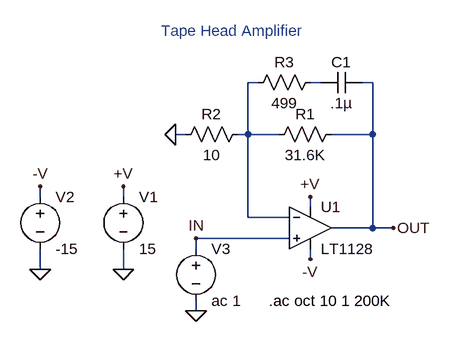
[diagram p0: schematic 1128.asc]
1128.asc, the LTspice schematic file:
Version 4
SHEET 1 896 680
WIRE 112 16 96 16
WIRE 208 16 192 16
WIRE 288 16 272 16
WIRE 0 96 -16 96
WIRE 96 96 96 16
WIRE 96 96 80 96
WIRE 144 96 96 96
WIRE 288 96 288 16
WIRE 288 96 224 96
WIRE -224 192 -224 176
WIRE -96 192 -96 176
WIRE 192 208 192 192
WIRE 96 224 96 96
WIRE 160 224 96 224
WIRE 288 240 288 96
WIRE 288 240 224 240
WIRE 320 240 288 240
WIRE 160 256 16 256
WIRE 16 272 16 256
WIRE 192 288 192 272
WIRE -224 304 -224 272
WIRE -96 304 -96 272
WIRE 16 368 16 352
FLAG -96 304 0
FLAG 192 192 +V
FLAG -96 176 +V
FLAG 192 288 -V
FLAG -224 304 0
FLAG -224 176 -V
FLAG -16 96 0
FLAG 16 368 0
FLAG 16 256 IN
FLAG 320 240 OUT
SYMBOL voltage -96 176 R0
SYMATTR InstName V1
SYMATTR Value 15
SYMBOL voltage -224 176 R0
SYMATTR InstName V2
SYMATTR Value -15
SYMBOL res 240 80 R90
WINDOW 0 0 56 VBottom 0
WINDOW 3 32 56 VTop 0
SYMATTR InstName R1
SYMATTR Value 31.6K
SYMBOL res 96 80 R90
WINDOW 0 0 56 VBottom 0
WINDOW 3 32 56 VTop 0
SYMATTR InstName R2
SYMATTR Value 10
SYMBOL voltage 16 256 R0
SYMATTR InstName V3
SYMATTR Value ac 1
SYMBOL cap 272 0 R90
WINDOW 0 0 32 VBottom 0
WINDOW 3 32 32 VTop 0
SYMATTR InstName C1
SYMATTR Value .1µ
SYMBOL res 208 0 R90
WINDOW 0 0 56 VBottom 0
WINDOW 3 32 56 VTop 0
SYMATTR InstName R3
SYMATTR Value 499
SYMBOL opamps\\LT1128 192 176 R0
SYMATTR InstName U1
TEXT 128 352 Left 0 !.ac oct 10 1 200K
TEXT 72 -48 Bottom 0 ;Tape Head Amplifier

The netlist it stands for:
* 1128.asc
V1 +V 0 15
V2 -V 0 -15
R1 OUT N001 31.6K
R2 N001 0 10
V3 IN 0 ac 1
C1 OUT N002 .1µ
R3 N002 N001 499
XU1 IN N001 +V -V OUT LT1128  ; pins In+ In- V+ V- OUT
.ac oct 10 1 200K
* Tape Head Amplifier
.lib LTC.lib
.backanno
.end